# Altium project ESP32_S3_Desgin.PrjPcb
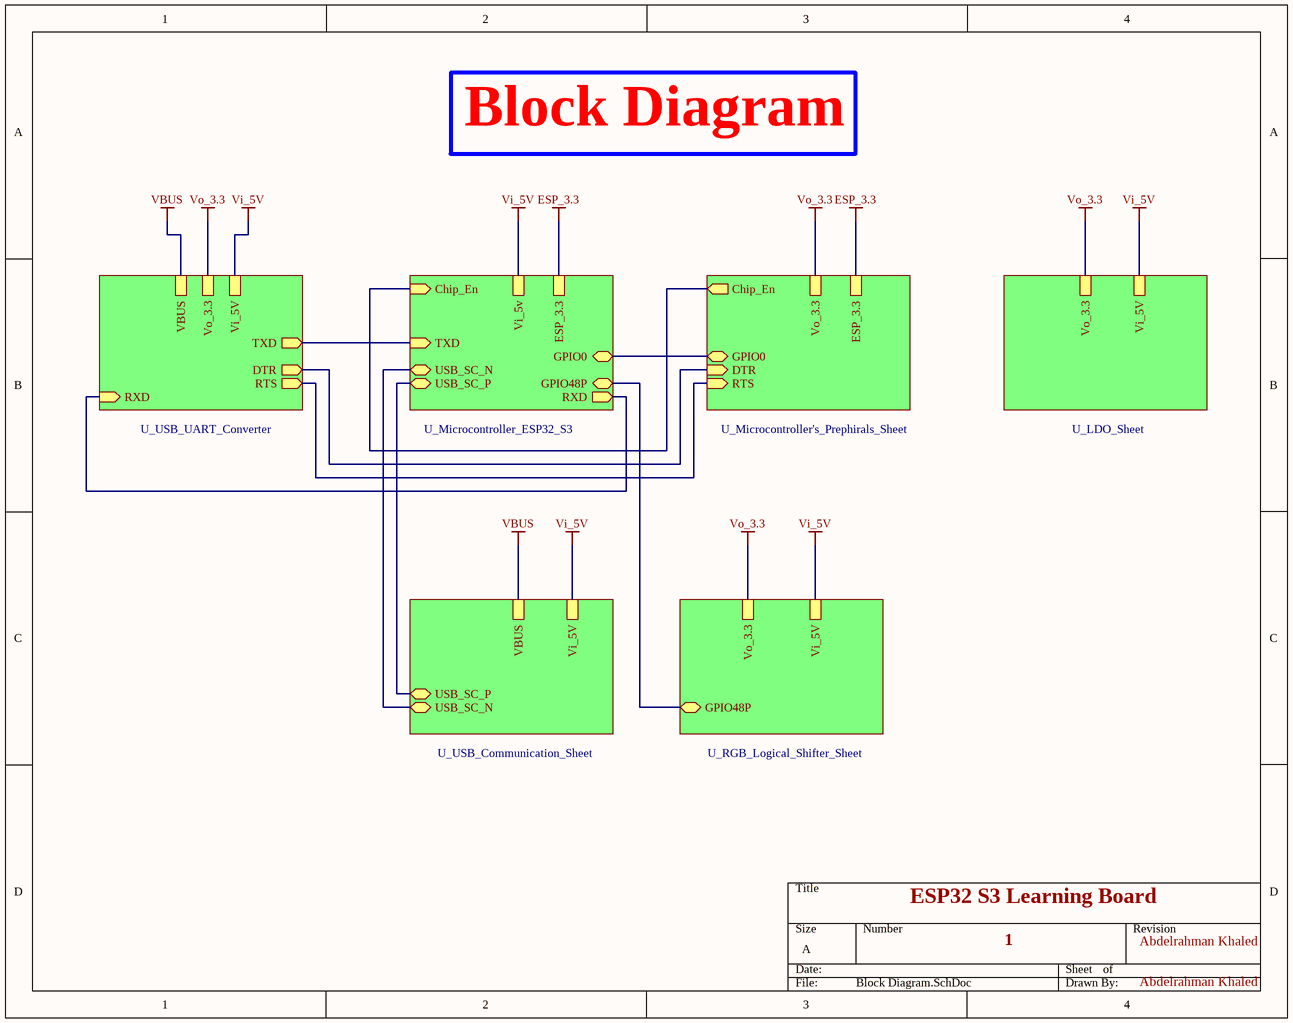
[diagram p0: Block Diagram.SchDoc]
Designer: Abdelrahman Khaled
7 sheets, 47 parts. Net scope: hierarchical (ports join the sheet entries above them; power ports are global).
Board file: ESP32_S3_PCB.PcbDoc
Sheets:
  Block Diagram.SchDoc
    U_LDO_Sheet = LDO_Sheet.SchDoc
    U_Microcontroller's_Prephirals_Sheet = Microcontroller's_Prephirals_Sheet.SchDoc
    U_Microcontroller_ESP32_S3 = Microcontroller_ESP32_S3.SchDoc
    U_RGB_Logical_Shifter_Sheet = RGB_Logical_Shifter_Sheet.SchDoc
    U_USB_Communication_Sheet = USB_Communication_Sheet.SchDoc
    U_USB_UART_Converter = USB_UART_Converter.SchDoc

## Sheet Block Diagram.SchDoc
size A; SheetNumber: 1; SheetTotal: 7

### Sub-sheets
U_LDO_Sheet = LDO_Sheet.SchDoc: Vi_5V, Vo_3.3
U_Microcontroller's_Prephirals_Sheet = Microcontroller's_Prephirals_Sheet.SchDoc: DTR (in), RTS (in), Chip_En (out), GPIO0 (bidir), Vo_3.3, ESP_3.3
U_Microcontroller_ESP32_S3 = Microcontroller_ESP32_S3.SchDoc: Chip_En (in), ESP_3.3, GPIO0 (bidir), GPIO48P (bidir), TXD (in), RXD (out), USB_SC_P (bidir), USB_SC_N (bidir), Vi_5v
U_RGB_Logical_Shifter_Sheet = RGB_Logical_Shifter_Sheet.SchDoc: Vi_5V, Vo_3.3, GPIO48P (bidir)
U_USB_Communication_Sheet = USB_Communication_Sheet.SchDoc: USB_SC_P (bidir), USB_SC_N (bidir), Vi_5V, VBUS
U_USB_UART_Converter = USB_UART_Converter.SchDoc: RTS (out), RXD (in), TXD (out), DTR (out), Vi_5V, Vo_3.3, VBUS

### Nets
ESP_3.3: sheet U_Microcontroller's_Prephirals_Sheet/Chip_En, sheet U_Microcontroller's_Prephirals_Sheet/ESP_3.3, sheet U_Microcontroller_ESP32_S3/Chip_En, sheet U_Microcontroller_ESP32_S3/ESP_3.3  [project net Chip_En]
VBUS: sheet U_USB_Communication_Sheet/VBUS, sheet U_USB_UART_Converter/VBUS
Vi_5V: sheet U_LDO_Sheet/Vi_5V, sheet U_Microcontroller_ESP32_S3/Vi_5v, sheet U_RGB_Logical_Shifter_Sheet/Vi_5V, sheet U_USB_Communication_Sheet/Vi_5V, sheet U_USB_UART_Converter/Vi_5V
Vo_3.3: sheet U_LDO_Sheet/Vo_3.3, sheet U_Microcontroller's_Prephirals_Sheet/Vo_3.3, sheet U_RGB_Logical_Shifter_Sheet/Vo_3.3, sheet U_USB_UART_Converter/Vo_3.3
DTR: sheet U_Microcontroller's_Prephirals_Sheet/DTR, sheet U_USB_UART_Converter/DTR
GPIO0: sheet U_Microcontroller's_Prephirals_Sheet/GPIO0, sheet U_Microcontroller_ESP32_S3/GPIO0
GPIO48: sheet U_Microcontroller_ESP32_S3/GPIO48P, sheet U_RGB_Logical_Shifter_Sheet/GPIO48P
RTS: sheet U_Microcontroller's_Prephirals_Sheet/RTS, sheet U_USB_UART_Converter/RTS
RXD0: sheet U_Microcontroller_ESP32_S3/TXD, sheet U_USB_UART_Converter/TXD
TXD0: sheet U_Microcontroller_ESP32_S3/RXD, sheet U_USB_UART_Converter/RXD
USB_SC_N: sheet U_Microcontroller_ESP32_S3/USB_SC_N, sheet U_USB_Communication_Sheet/USB_SC_N
USB_SC_P: sheet U_Microcontroller_ESP32_S3/USB_SC_P, sheet U_USB_Communication_Sheet/USB_SC_P

### Notes on the sheet
- Block Diagram
- ESP32 S3 Learning Board
- 1
- Abdelrahman Khaled

## Sheet LDO_Sheet.SchDoc
size A; SheetNumber: 5; SheetTotal: 7
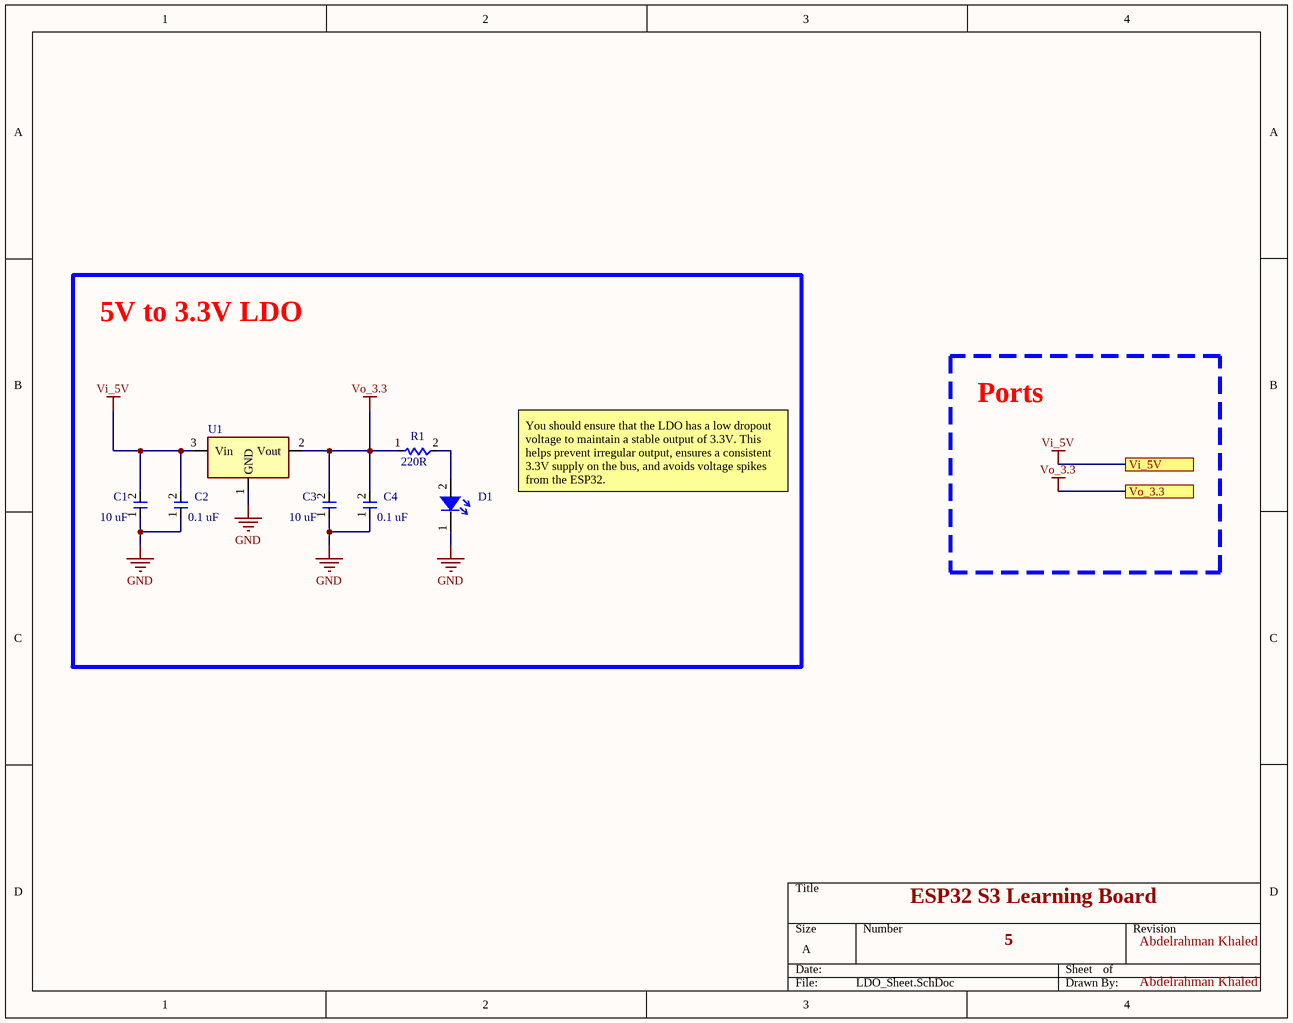
[diagram p1: LDO_Sheet.SchDoc]

### Parts
C1  10 uF  [Capacitor]
C2  0.1 uF  [Capacitor]
C3  10 uF  [Capacitor]
C4  0.1 uF  [Capacitor]
D1  Red Led  [Led]  (value not drawn)
R1  220R  [Resistor]
U1  Regulator LDO 3.3V  [Regulator 3.3V]  (value not drawn)

### Blocks framed on the sheet
5V to 3.3V LDO: C1-C4 D1 R1 U1

### Ports
Vi_5V (see Block Diagram[4B], Microcontroller_ESP32_S3[4D], RGB_Logical_Shifter_Sheet[4A], USB_Communication_Sheet[4B], USB_UART_Converter[4A]), Vo_3.3 (see Block Diagram[4B], Microcontroller's_Prephirals_Sheet[4A], RGB_Logical_Shifter_Sheet[4A], USB_UART_Converter[4A])

### Nets
GND: C1.1(Pin_1) C2.1(Pin_1) C3.1(Pin_1) C4.1(Pin_1) D1.1 U1.1(GND)
Vi_5V: C1.2(Pin_2) C2.2(Pin_2) U1.3(Vin) ; port Vi_5V
Vo_3.3: C3.2(Pin_2) C4.2(Pin_2) R1.1(Pin_1) U1.2(Vout) ; port Vo_3.3
NetD1_2: D1.2 R1.2(pin_2)

### Notes on the sheet
- Ports
- You should ensure that the LDO has a low dropout voltage to maintain a stable output of 3.3V. This helps prevent irregular output, ensures a consistent 3.3V supply on the bus, and avoids voltage spikes from the ESP32.
- ESP32 S3 Learning Board
- 5
- Abdelrahman Khaled

### Library data of the parts
C1-C4 = Capacitor
D1 = LED: https://www.digikey.com/en/products/detail/yongyu-optoelectronics/YY0402BL-NN3S0-T1AR4/25558564?s=N4IgjCBcoLQCxVAYygMwIYBsDOBTANCAPZQDaIAnAMxhwQC6AvoTAGyIgqQAuATgK4FiZEFRBNmIAEwiqAOioA1AAQB5AHLKAMgFEAIuMZA
R1 = Resistance

## Sheet Microcontroller's_Prephirals_Sheet.SchDoc
size A; SheetNumber: 3; SheetTotal: 7
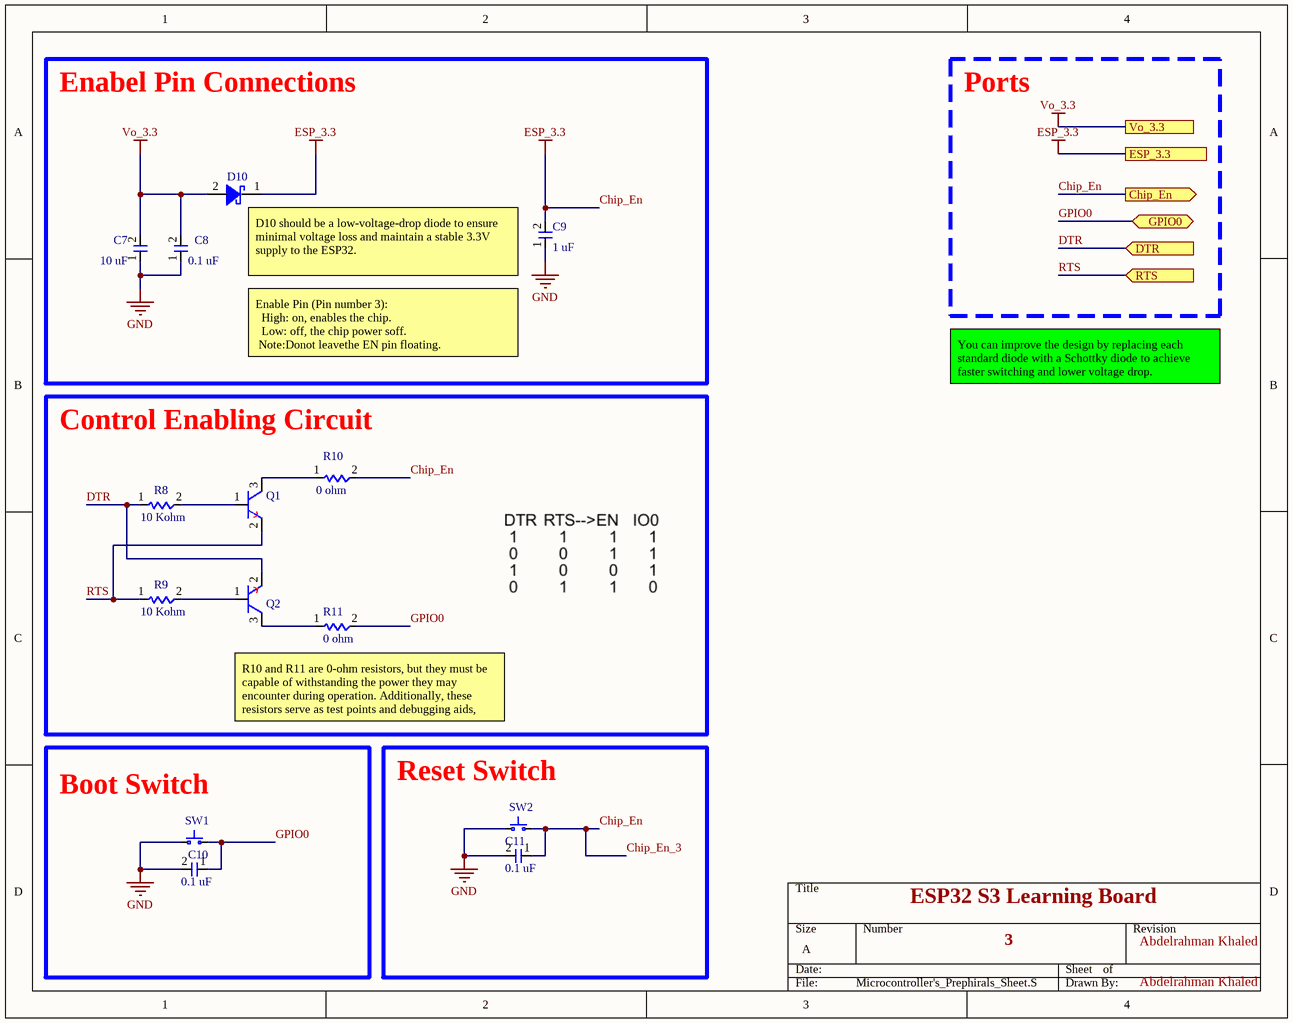
[diagram p2: Microcontroller's_Prephirals_Sheet.SchDoc]

### Parts
C7  10 uF  [Capacitor]
C8  0.1 uF  [Capacitor]
C9  1 uF  [Capacitor]
C10  0.1 uF  [Capacitor]
C11  0.1 uF  [Capacitor]
D10  0.2V Drop Volt  [Schoktty Diode]  (value not drawn)
Q1  NPN Transistor  [NPN Transistor]  (value not drawn)
Q2  NPN Transistor  [NPN Transistor]  (value not drawn)
R8  10 Kohm  [Resistor]
R9  10 Kohm  [Resistor]
R10  0 ohm  [Resistor]
R11  0 ohm  [Resistor]
SW1  Push Button  [Push Button]  (value not drawn)
SW2  Push Button  [Push Button]  (value not drawn)

### Blocks framed on the sheet
Enabel Pin Connections: C7-C9 D10
Control Enabling Circuit: Q1 Q2 R8-R11
Boot Switch: C10 SW1
Reset Switch: C11 SW2

### Ports
Chip_En (out, see Block Diagram[3B], Microcontroller_ESP32_S3[4C]), DTR (in, see Block Diagram[3B], USB_UART_Converter[3B]), ESP_3.3 (see Block Diagram[3B], Microcontroller_ESP32_S3[4C]), GPIO0 (bidir, see Block Diagram[3B], Microcontroller_ESP32_S3[4C]), RTS (in, see Block Diagram[3B], USB_UART_Converter[3B]), Vo_3.3 (see Block Diagram[3B], LDO_Sheet[4B], RGB_Logical_Shifter_Sheet[4A], USB_UART_Converter[4A])

### Nets
Chip_En: C9.2(Pin_2) C11.1(Pin_1) D10.1 R10.2(pin_2) SW2.2 ; port Chip_En, port ESP_3.3  [also labelled Chip_En_3, ESP_3.3]
GND: C7.1(Pin_1) C8.1(Pin_1) C9.1(Pin_1) C10.2(Pin_2) C11.2(Pin_2) SW1.1 SW2.1
Vo_3.3: C7.2(Pin_2) C8.2(Pin_2) D10.2 ; port Vo_3.3
DTR: Q2.2 R8.1(Pin_1) ; port DTR
GPIO0: C10.1(Pin_1) R11.2(pin_2) SW1.2 ; port GPIO0
RTS: Q1.2 R9.1(Pin_1) ; port RTS
NetQ1_1: Q1.1 R8.2(pin_2)
NetQ1_3: Q1.3 R10.1(Pin_1)
NetQ2_1: Q2.1 R9.2(pin_2)
NetQ2_3: Q2.3 R11.1(Pin_1)

### Notes on the sheet
- Ports
- (near D10) D10 should be a low-voltage-drop diode to ensure minimal voltage loss and maintain a stable 3.3V supply to the ESP32.
- Enable Pin (Pin number 3):
  High: on, enables the chip.
  Low: off, the chip power soff.
  Note:Donot leavethe EN pin floating.
- You can improve the design by replacing each standard diode with a Schottky diode to achieve faster switching and lower voltage drop.
- R10 and R11 are 0-ohm resistors, but they must be capable of withstanding the power they may encounter during operation. Additionally, these resistors serve as test points and debugging aids, allowing isolation or monitoring in case of faults in the circuit.
- ESP32 S3 Learning Board
- 3
- Abdelrahman Khaled

### Library data of the parts
C7-C11 = Capacitor
D10 = Schottky Diode: NRVB120ESFT1G; ComponentLink1Description: Link; ComponentLink1URL: https://www.digikey.com/en/products/detail/onsemi/NSR20F40NXT5G/5801655
Q1 Q2 = NPN Transistor: TRANS PREBIAS NPN 50V TO236AB; Links: https://www.digikey.com/en/products/detail/nexperia-usa-inc/PDTD114ETR/5035778
R8-R11 = Resistance
SW1 SW2 = Push Button: Links: https://www.digikey.com/en/products/detail/w%C3%BCrth-elektronik/434133025816/9950810

## Sheet Microcontroller_ESP32_S3.SchDoc
size A; SheetNumber: 2; SheetTotal: 7
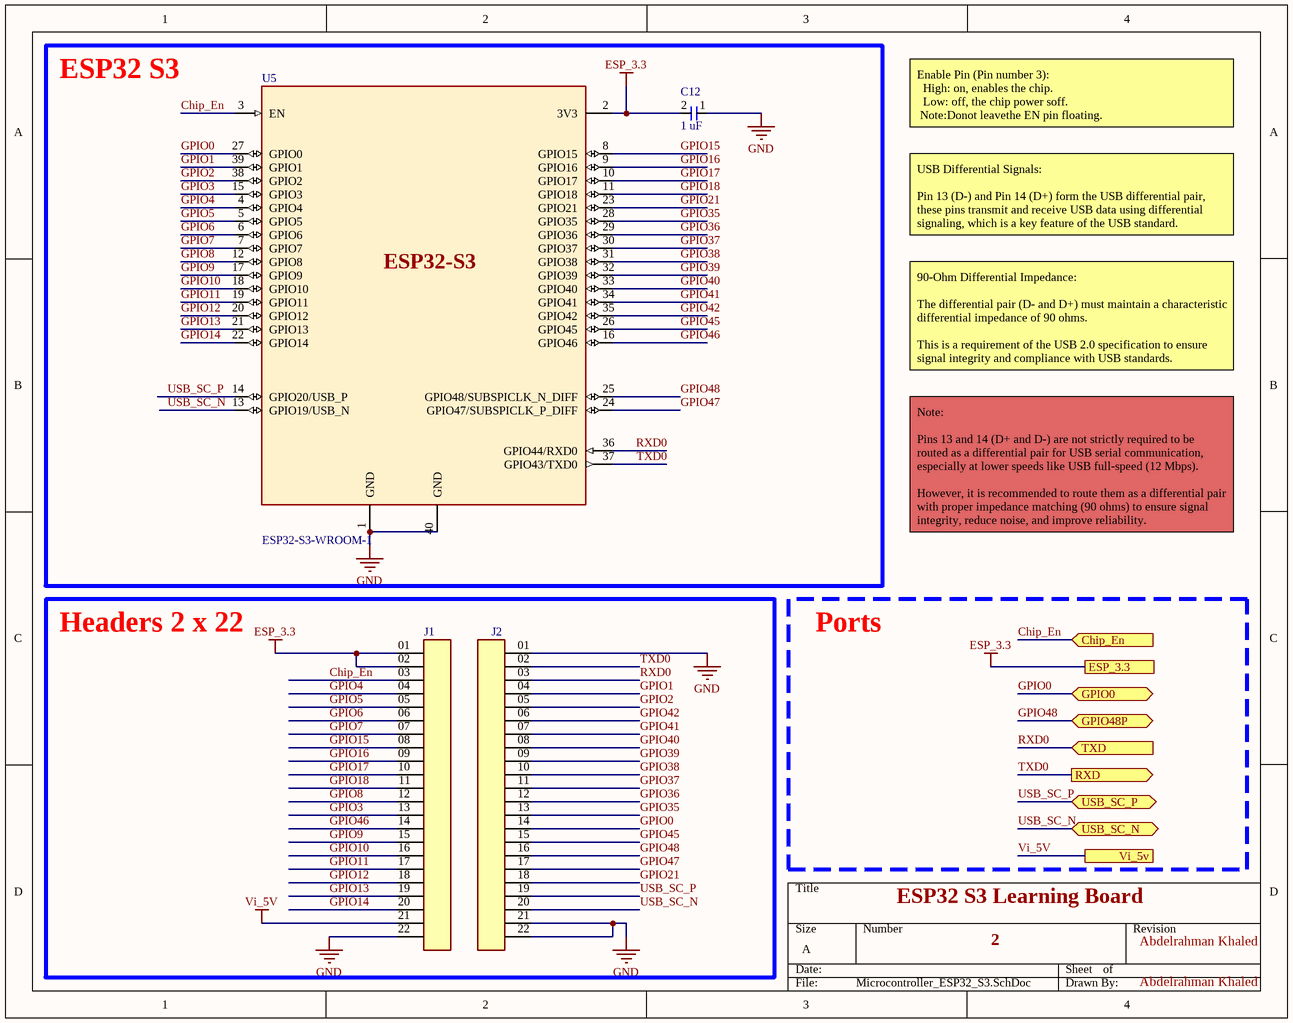
[diagram p3: Microcontroller_ESP32_S3.SchDoc]

### Parts
C12  1 uF  [Capacitor]
J1  Header 1x22  [Header 1xx22]  (value not drawn)
J2  Header 1x22  [Header 1xx22]  (value not drawn)
U5  ESP32-S3-WROOM-1  [ESP32-S3-WROOM-1-N4]

### Blocks framed on the sheet
ESP32 S3: C12 U5
Headers 2 x 22: J1 J2

### Ports
Chip_En (in, see Block Diagram[2B], Microcontroller's_Prephirals_Sheet[4A]), ESP_3.3 (see Block Diagram[2B], Microcontroller's_Prephirals_Sheet[4A]), GPIO0 (bidir, see Block Diagram[2B], Microcontroller's_Prephirals_Sheet[4A]), GPIO48P (bidir, see Block Diagram[2B], RGB_Logical_Shifter_Sheet[4A]), RXD (out, see Block Diagram[2B], USB_UART_Converter[3B]), TXD (in, see Block Diagram[2B], USB_UART_Converter[3B]), USB_SC_N (bidir, see Block Diagram[2B], USB_Communication_Sheet[4C]), USB_SC_P (bidir, see Block Diagram[2B], USB_Communication_Sheet[4B]), Vi_5v (see Block Diagram[2B], LDO_Sheet[4B], RGB_Logical_Shifter_Sheet[4A], USB_Communication_Sheet[4B], USB_UART_Converter[4A])

### Nets
Chip_En: C12.2(Pin_2) J1.01 J1.02 J1.03 U5.2(3V3) U5.3(EN) ; port Chip_En, port ESP_3.3  [also labelled ESP_3.3]
GND: C12.1(Pin_1) J1.22 J2.01 J2.21 J2.22 U5.1(GND) U5.40(GND)
Vi_5V: J1.21 ; port Vi_5v
GPIO0: J2.14 U5.27(GPIO0) ; port GPIO0
GPIO1: J2.04 U5.39(GPIO1)
GPIO2: J2.05 U5.38(GPIO2)
GPIO3: J1.13 U5.15(GPIO3)
GPIO4: J1.04 U5.4(GPIO4)
GPIO5: J1.05 U5.5(GPIO5)
GPIO6: J1.06 U5.6(GPIO6)
GPIO7: J1.07 U5.7(GPIO7)
GPIO8: J1.12 U5.12(GPIO8)
GPIO9: J1.15 U5.17(GPIO9)
GPIO10: J1.16 U5.18(GPIO10)
GPIO11: J1.17 U5.19(GPIO11)
GPIO12: J1.18 U5.20(GPIO12)
GPIO13: J1.19 U5.21(GPIO13)
GPIO14: J1.20 U5.22(GPIO14)
GPIO15: J1.08 U5.8(GPIO15)
GPIO16: J1.09 U5.9(GPIO16)
GPIO17: J1.10 U5.10(GPIO17)
GPIO18: J1.11 U5.11(GPIO18)
GPIO21: J2.18 U5.23(GPIO21)
GPIO35: J2.13 U5.28(GPIO35)
GPIO36: J2.12 U5.29(GPIO36)
GPIO37: J2.11 U5.30(GPIO37)
GPIO38: J2.10 U5.31(GPIO38)
GPIO39: J2.09 U5.32(GPIO39)
GPIO40: J2.08 U5.33(GPIO40)
GPIO41: J2.07 U5.34(GPIO41)
GPIO42: J2.06 U5.35(GPIO42)
GPIO45: J2.15 U5.26(GPIO45)
GPIO46: J1.14 U5.16(GPIO46)
GPIO47: J2.17 U5.24(GPIO47/SUBSPICLK_P_DIFF)
GPIO48: J2.16 U5.25(GPIO48/SUBSPICLK_N_DIFF) ; port GPIO48P
RXD0: J2.03 U5.36(GPIO44/RXD0) ; port TXD
TXD0: J2.02 U5.37(GPIO43/TXD0) ; port RXD
USB_SC_N: J2.20 U5.13(GPIO19/USB_N) ; port USB_SC_N
USB_SC_P: J2.19 U5.14(GPIO20/USB_P) ; port USB_SC_P

### Notes on the sheet
- Enable Pin (Pin number 3):
  High: on, enables the chip.
  Low: off, the chip power soff.
  Note:Donot leavethe EN pin floating.
- USB Differential Signals:
  Pin 13 (D-) and Pin 14 (D+) form the USB differential pair, these pins transmit and receive USB data using differential signaling, which is a key feature of the USB standard.
- 90-Ohm Differential Impedance:
  The differential pair (D- and D+) must maintain a characteristic differential impedance of 90 ohms.
  This is a requirement of the USB 2.0 specification to ensure signal integrity and compliance with USB standards.
- Note:
  Pins 13 and 14 (D+ and D-) are not strictly required to be routed as a differential pair for USB serial communication, especially at lower speeds like USB full-speed (12 Mbps).
  However, it is recommended to route them as a differential pair with proper impedance matching (90 ohms) to ensure signal integrity, reduce noise, and improve reliability.
- Ports
- ESP32 S3 Learning Board
- 2
- Abdelrahman Khaled
- (in symbol ESP32-S3-WROOM-1) ESP32-S3

### Library data of the parts
C12 = Capacitor
U5 = ESP32-S3-WROOM-1: 2.4 GHz Wi-Fi (802.11b/g/n) and Bluetooth® 5 module / Built around ESP32-S3 series of SoCs, Xtensa® dual-core 32-bit LX7 microprocessor / Flash up to 16 MB, PSRAM up to 16 MB / Up to 36 GPIOs, rich set of peripherals / On-board PCB antenna or external antenna connector; ComponentLink1Description: Links; ComponentLink1URL: https://docs.espressif.com/projects/esp-dev-kits/en/latest/esp32s3/esp32-s3-devkitc-1/user_guide_v1.0.html#hardware-reference

## Sheet RGB_Logical_Shifter_Sheet.SchDoc
size A; SheetNumber: 4; SheetTotal: 7
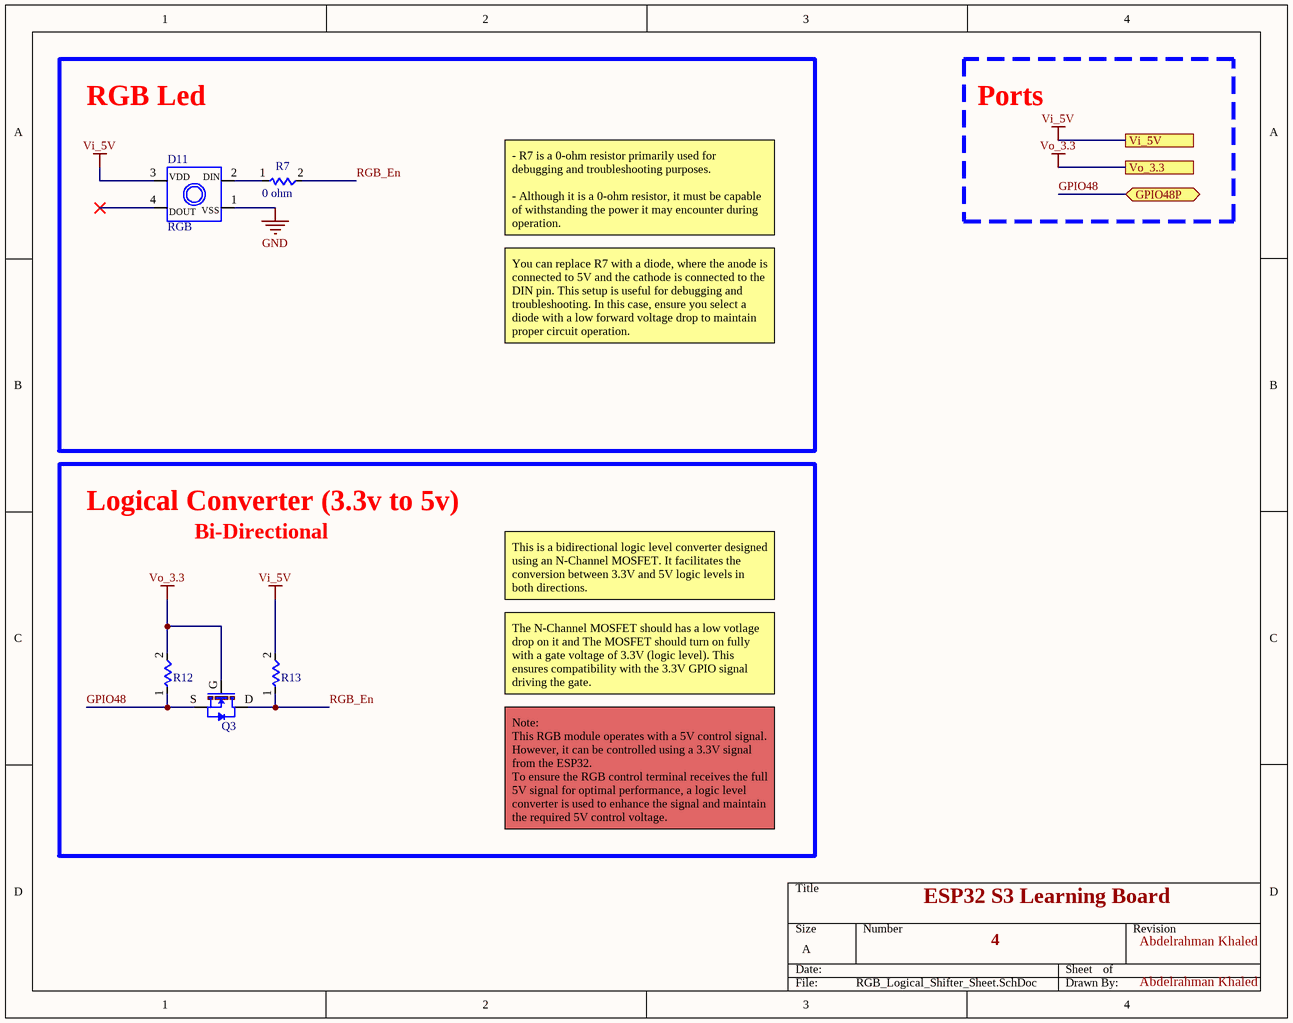
[diagram p4: RGB_Logical_Shifter_Sheet.SchDoc]

### Parts
D11  RGB  [RGB]
Q3  MOSFET_BSS138  [MOSFET_BSS138]  (value not drawn)
R7  0 ohm  [Resistor]
R12  10K ohm  [Resistor]  (value not drawn)
R13  10K ohm  [Resistor]  (value not drawn)

### Blocks framed on the sheet
RGB Led: D11 R7
Logical Converter (3.3v to 5v): Q3 R12 R13

### Ports
GPIO48P (bidir, see Block Diagram[3C], Microcontroller_ESP32_S3[4C]), Vi_5V (see Block Diagram[3C], LDO_Sheet[4B], Microcontroller_ESP32_S3[4D], USB_Communication_Sheet[4B], USB_UART_Converter[4A]), Vo_3.3 (see Block Diagram[3C], LDO_Sheet[4B], Microcontroller's_Prephirals_Sheet[4A], USB_UART_Converter[4A])

### Nets
GND: D11.1
Vi_5V: D11.3 R13.2(pin_2) ; port Vi_5V
Vo_3.3: Q3.G R12.2(pin_2) ; port Vo_3.3
GPIO48: Q3.S R12.1(Pin_1) ; port GPIO48P
RGB_En: Q3.D R7.2(pin_2) R13.1(Pin_1)
NetD11_2: D11.2 R7.1(Pin_1)

Not connected (* = marked no-connect by the designer): D11 4*

### Notes on the sheet
- Ports
- - R7 is a 0-ohm resistor primarily used for debugging and troubleshooting purposes.
  - Although it is a 0-ohm resistor, it must be capable of withstanding the power it may encounter during operation.
- You can replace R7 with a diode, where the anode is connected to 5V and the cathode is connected to the DIN pin. This setup is useful for debugging and troubleshooting. In this case, ensure you select a diode with a low forward voltage drop to maintain proper circuit operation.
- Bi-Directional
- This is a bidirectional logic level converter designed using an N-Channel MOSFET. It facilitates the conversion between 3.3V and 5V logic levels in both directions.
- The N-Channel MOSFET should has a low votlage drop on it and The MOSFET should turn on fully with a gate voltage of 3.3V (logic level). This ensures compatibility with the 3.3V GPIO signal driving the gate.
- Note:
  This RGB module operates with a 5V control signal. However, it can be controlled using a 3.3V signal from the ESP32.
  To ensure the RGB control terminal receives the full 5V signal for optimal performance, a logic level converter is used to enhance the signal and maintain the required 5V control voltage.
- ESP32 S3 Learning Board
- 4
- Abdelrahman Khaled
- (in symbol RGB) VDD; DIN; VSS; DOUT

### Library data of the parts
D11 = RGB: LED RGB CLEAR 3528 SMD
Q3 = MOSFET_BSS138: MOSFET N-CH 50V 220MA SOT23; Link: https://www.digikey.com/en/products/detail/micro-commercial-co/BSS138-TP/10054628
R7 R12 R13 = Resistance: Fuse Reseitance

## Sheet USB_Communication_Sheet.SchDoc
size A; SheetNumber: 7; SheetTotal: 7
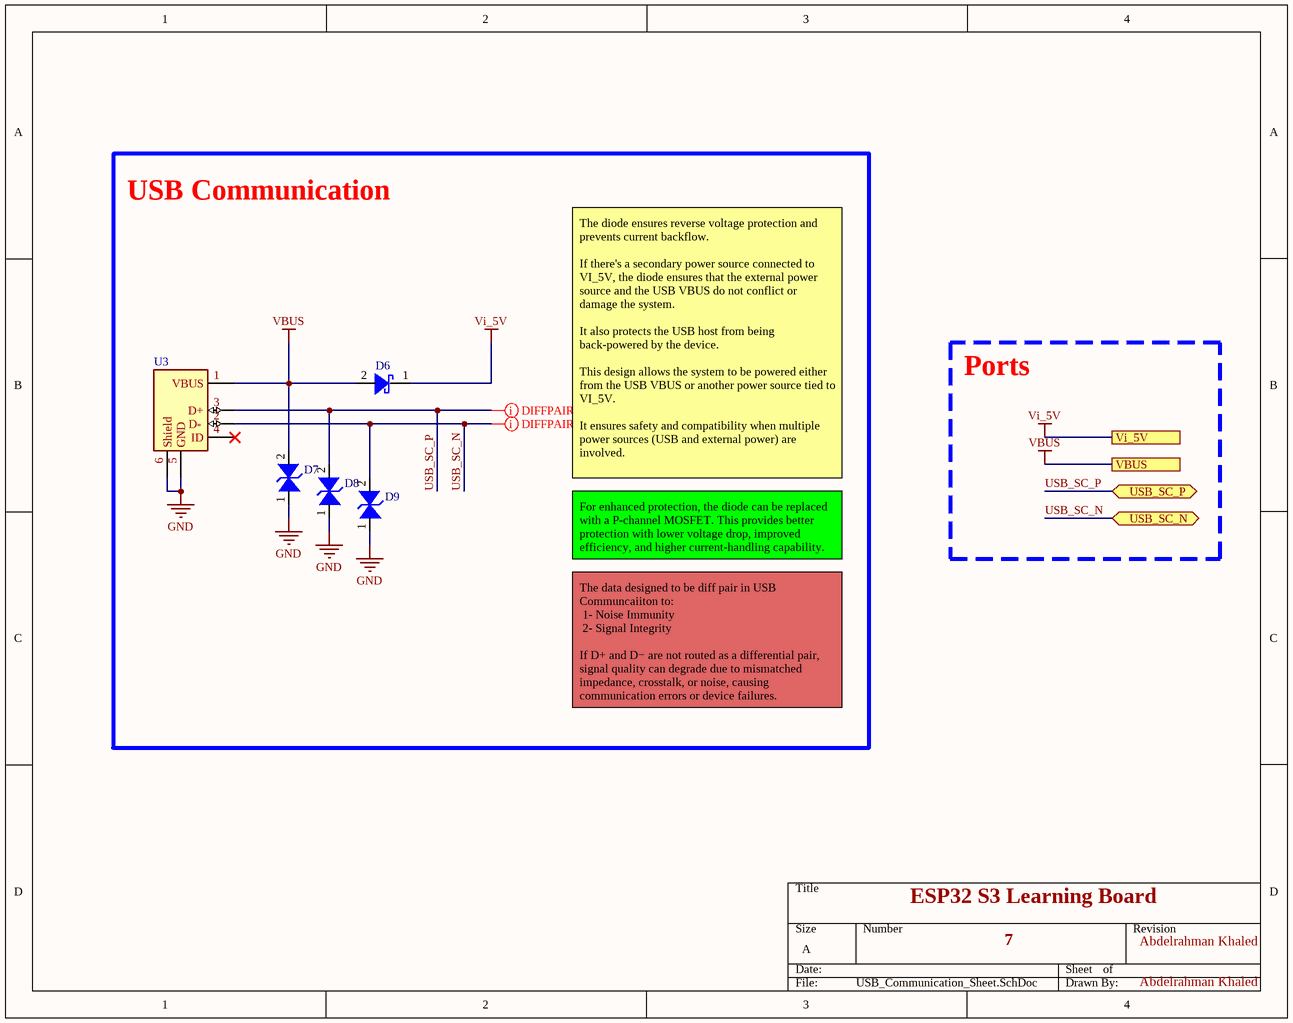
[diagram p5: USB_Communication_Sheet.SchDoc]

### Parts
D6  0.2V Drop Volt  [Schoktty Diode]  (value not drawn)
D7  TVS Diode  [TVS Diode]  (value not drawn)
D8  TVS Diode  [TVS Diode]  (value not drawn)
D9  TVS Diode  [TVS Diode]  (value not drawn)
U3  USB_B Micro  [USB8_Micro]  (value not drawn)

### Blocks framed on the sheet
USB Communication: D6-D9 U3

### Ports
USB_SC_N (bidir, see Block Diagram[2C], Microcontroller_ESP32_S3[4D]), USB_SC_P (bidir, see Block Diagram[2C], Microcontroller_ESP32_S3[4D]), VBUS (see Block Diagram[2C], USB_UART_Converter[4B]), Vi_5V (see Block Diagram[2C], LDO_Sheet[4B], Microcontroller_ESP32_S3[4D], RGB_Logical_Shifter_Sheet[4A], USB_UART_Converter[4A])

### Nets
GND: D7.1 D8.1 D9.1 U3.5(GND) U3.6(Shield)
VBUS: D6.2 D7.2 U3.1(VBUS) ; port VBUS
Vi_5V: D6.1 ; port Vi_5V
USB_SC_N: D9.2 U3.2(D-) ; port USB_SC_N
USB_SC_P: D8.2 U3.3(D+) ; port USB_SC_P

Not connected (* = marked no-connect by the designer): U3 4(ID)*

### Layout directives
differential pair; differential pair class Diff_90_ohm: USB_SC_N, USB_SC_P

### Notes on the sheet
- Ports
- The diode ensures reverse voltage protection and prevents current backflow.
  If there's a secondary power source connected to VI_5V, the diode ensures that the external power source and the USB VBUS do not conflict or damage the system.
  It also protects the USB host from being back-powered by the device.
  This design allows the system to be powered either from the USB VBUS or another power source tied to VI_5V.
  It ensures safety and compatibility when multiple power sources (USB and external power) are involved.
- For enhanced protection, the diode can be replaced with a P-channel MOSFET. This provides better protection with lower voltage drop, improved efficiency, and higher current-handling capability.
- The data designed to be diff pair in USB Communcaiiton to:
  1- Noise Immunity
  2- Signal Integrity
  If D+ and D− are not routed as a differential pair, signal quality can degrade due to mismatched impedance, crosstalk, or noise, causing communication errors or device failures.
- ESP32 S3 Learning Board
- 7
- Abdelrahman Khaled

### Library data of the parts
D6 = Schottky Diode: NRVB120ESFT1G; ComponentLink1Description: Link; ComponentLink1URL: https://www.digikey.com/en/products/detail/onsemi/NSR20F40NXT5G/5801655

## Sheet USB_UART_Converter.SchDoc
size A; SheetNumber: 6; SheetTotal: 7
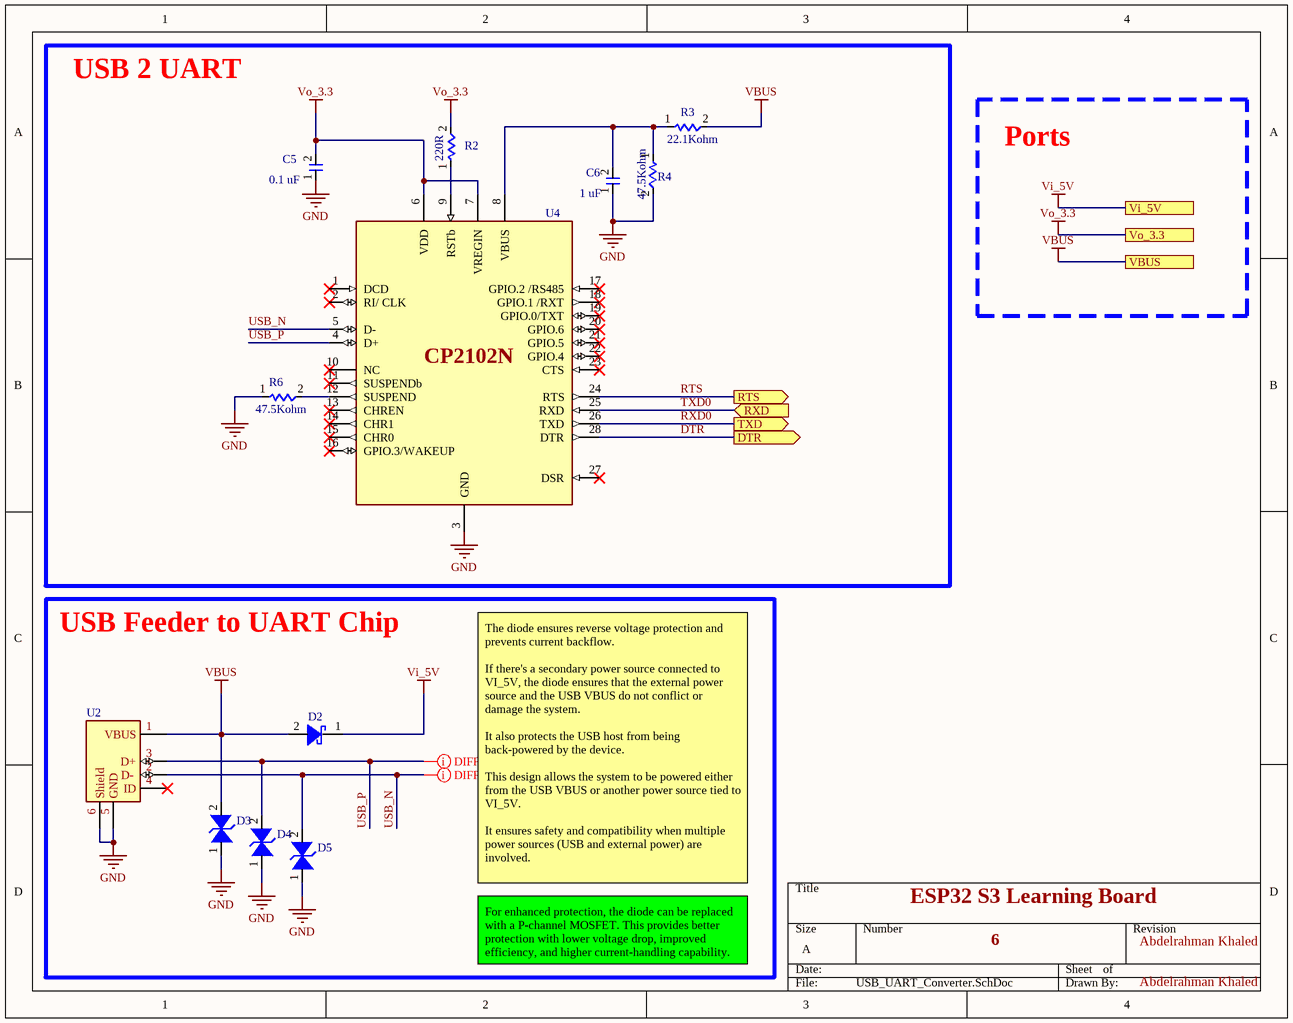
[diagram p6: USB_UART_Converter.SchDoc]

### Parts
C5  0.1 uF  [Capacitor]
C6  1 uF  [Capacitor]
D2  0.2V Drop Volt  [Schoktty Diode]  (value not drawn)
D3  TVS Diode  [TVS Diode]  (value not drawn)
D4  TVS Diode  [TVS Diode]  (value not drawn)
D5  TVS Diode  [TVS Diode]  (value not drawn)
R2  220R  [Resistor]
R3  22.1Kohm  [Resistor]
R4  47.5Kohm  [Resistor]
R6  47.5Kohm  [Resistor]
U2  USB_B Micro  [USB8_Micro]  (value not drawn)
U4  CP2102N  [CP2102N]  (value not drawn)

### Blocks framed on the sheet
USB 2 UART: C5 C6 R2-R4 R6 U4
USB Feeder to UART Chip: D2-D5 U2

### Ports
DTR (out, see Block Diagram[1B], Microcontroller's_Prephirals_Sheet[4A]), RTS (out, see Block Diagram[1B], Microcontroller's_Prephirals_Sheet[4B]), RXD (in, see Block Diagram[1B], Microcontroller_ESP32_S3[4D]), TXD (out, see Block Diagram[1B], Microcontroller_ESP32_S3[4C]), VBUS (see Block Diagram[1B], USB_Communication_Sheet[4B]), Vi_5V (see Block Diagram[1B], LDO_Sheet[4B], Microcontroller_ESP32_S3[4D], RGB_Logical_Shifter_Sheet[4A], USB_Communication_Sheet[4B]), Vo_3.3 (see Block Diagram[1B], LDO_Sheet[4B], Microcontroller's_Prephirals_Sheet[4A], RGB_Logical_Shifter_Sheet[4A])

### Nets
GND: C5.1(Pin_1) C6.1(Pin_1) D3.1 D4.1 D5.1 R4.2(pin_2) R6.1(Pin_1) U2.5(GND) U2.6(Shield) U4.3(GND)
VBUS: D2.2 D3.2 R3.2(pin_2) U2.1(VBUS) ; port VBUS
Vi_5V: D2.1 ; port Vi_5V
Vo_3.3: C5.2(Pin_2) R2.2(pin_2) U4.6(VDD) U4.7(VREGIN) ; port Vo_3.3
DTR: U4.28(DTR) ; port DTR
RTS: U4.24(RTS) ; port RTS
RXD0: U4.26(TXD) ; port TXD
TXD0: U4.25(RXD) ; port RXD
USB_N: D5.2 U2.2(D-) U4.5(D-)
USB_P: D4.2 U2.3(D+) U4.4(D+)
NetC6_2: C6.2(Pin_2) R3.1(Pin_1) R4.1(Pin_1) U4.8(VBUS)
NetR2_1: R2.1(Pin_1) U4.9(RSTb)
NetR6_2: R6.2(pin_2) U4.12(SUSPEND)

Not connected (* = marked no-connect by the designer): U2 4(ID)*; U4 1(DCD)* 2(RI/_CLK)* 10(NC)* 11(SUSPENDb)* 13(CHREN)* 14(CHR1)* 15(CHR0)* 16(GPIO.3/WAKEUP)* 17(GPIO.2_/RS485)* 18(GPIO.1_/RXT)* 19(GPIO.0/TXT)* 20(_GPIO.6)* 21(_GPIO.5)* 22(_GPIO.4)* 23(CTS)* 27(DSR)*

### Layout directives
differential pair; differential pair class Diff_90_ohm: USB_N, USB_P

### Notes on the sheet
- Ports
- The diode ensures reverse voltage protection and prevents current backflow.
  If there's a secondary power source connected to VI_5V, the diode ensures that the external power source and the USB VBUS do not conflict or damage the system.
  It also protects the USB host from being back-powered by the device.
  This design allows the system to be powered either from the USB VBUS or another power source tied to VI_5V.
  It ensures safety and compatibility when multiple power sources (USB and external power) are involved.
- ESP32 S3 Learning Board
- For enhanced protection, the diode can be replaced with a P-channel MOSFET. This provides better protection with lower voltage drop, improved efficiency, and higher current-handling capability.
- 6
- Abdelrahman Khaled

### Library data of the parts
C5 C6 = Capacitor
D2 = Schottky Diode: NRVB120ESFT1G; ComponentLink1Description: Link; ComponentLink1URL: https://www.digikey.com/en/products/detail/onsemi/NSR20F40NXT5G/5801655
R2-R4 R6 = Resistance

## Nets that join several sheets
Chip_En: Microcontroller's_Prephirals_Sheet (5 pins), Microcontroller_ESP32_S3 (6 pins)
GND: LDO_Sheet (6 pins), Microcontroller's_Prephirals_Sheet (7 pins), Microcontroller_ESP32_S3 (7 pins), RGB_Logical_Shifter_Sheet (D11.1), USB_Communication_Sheet (5 pins), USB_UART_Converter (10 pins)
VBUS: USB_Communication_Sheet (D6.2 D7.2 U3.1), USB_UART_Converter (D2.2 D3.2 R3.2 U2.1)
Vi_5V: LDO_Sheet (C1.2 C2.2 U1.3), Microcontroller_ESP32_S3 (J1.21), RGB_Logical_Shifter_Sheet (D11.3 R13.2), USB_Communication_Sheet (D6.1), USB_UART_Converter (D2.1)
Vo_3.3: LDO_Sheet (C3.2 C4.2 R1.1 U1.2), Microcontroller's_Prephirals_Sheet (C7.2 C8.2 D10.2), RGB_Logical_Shifter_Sheet (Q3.G R12.2), USB_UART_Converter (C5.2 R2.2 U4.6 U4.7)
DTR: Microcontroller's_Prephirals_Sheet (Q2.2 R8.1), USB_UART_Converter (U4.28)
GPIO0: Microcontroller's_Prephirals_Sheet (C10.1 R11.2 SW1.2), Microcontroller_ESP32_S3 (J2.14 U5.27)
GPIO48: Microcontroller_ESP32_S3 (J2.16 U5.25), RGB_Logical_Shifter_Sheet (Q3.S R12.1)
RTS: Microcontroller's_Prephirals_Sheet (Q1.2 R9.1), USB_UART_Converter (U4.24)
RXD0: Microcontroller_ESP32_S3 (J2.03 U5.36), USB_UART_Converter (U4.26)
TXD0: Microcontroller_ESP32_S3 (J2.02 U5.37), USB_UART_Converter (U4.25)
USB_SC_N: Microcontroller_ESP32_S3 (J2.20 U5.13), USB_Communication_Sheet (D9.2 U3.2)
USB_SC_P: Microcontroller_ESP32_S3 (J2.19 U5.14), USB_Communication_Sheet (D8.2 U3.3)